# EAGLE schematic Sensor2 (EAGLE 9.3.0)
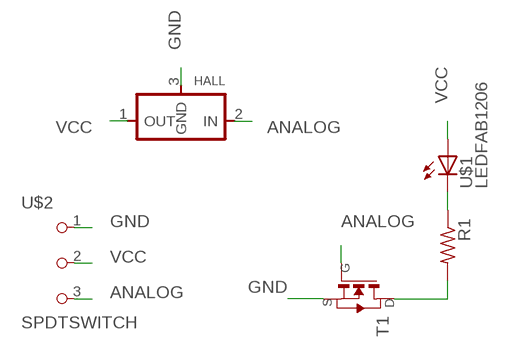
[diagram p0: schematic, sheet 1]

## Parts
HALL  REGULATORSOT23  [SOT23]
R1  RES-US1206FAB  [R1206FAB]
T1  NMOSFETSOT23  [SOT-23]
U$1  LEDFAB1206  [LED1206FAB]
U$2  SPDTSWITCH  [SPDTSWITCH]

## Nets
ANALOG: HALL.2(IN) T1.3(G) U$2.3
GND: HALL.3(GND) T1.2(S) U$2.1
N$1: R1.1 U$1.2(C)
N$2: R1.2 T1.1(D)
VCC: HALL.1(OUT) U$1.1(A) U$2.2

## Library data of the parts
HALL = fab:REGULATOR
R1 = fab:RES-US: Resistor (US Symbol) Variants with postfix FAB are widened to allow the routing of internal traces
T1 = fab:NMOSFET: MOS FET
U$1 = fab:LED: LED
U$2 = fab:SPDTSWITCH